# EAGLE design fhd-gs (EAGLE 9.6.2)
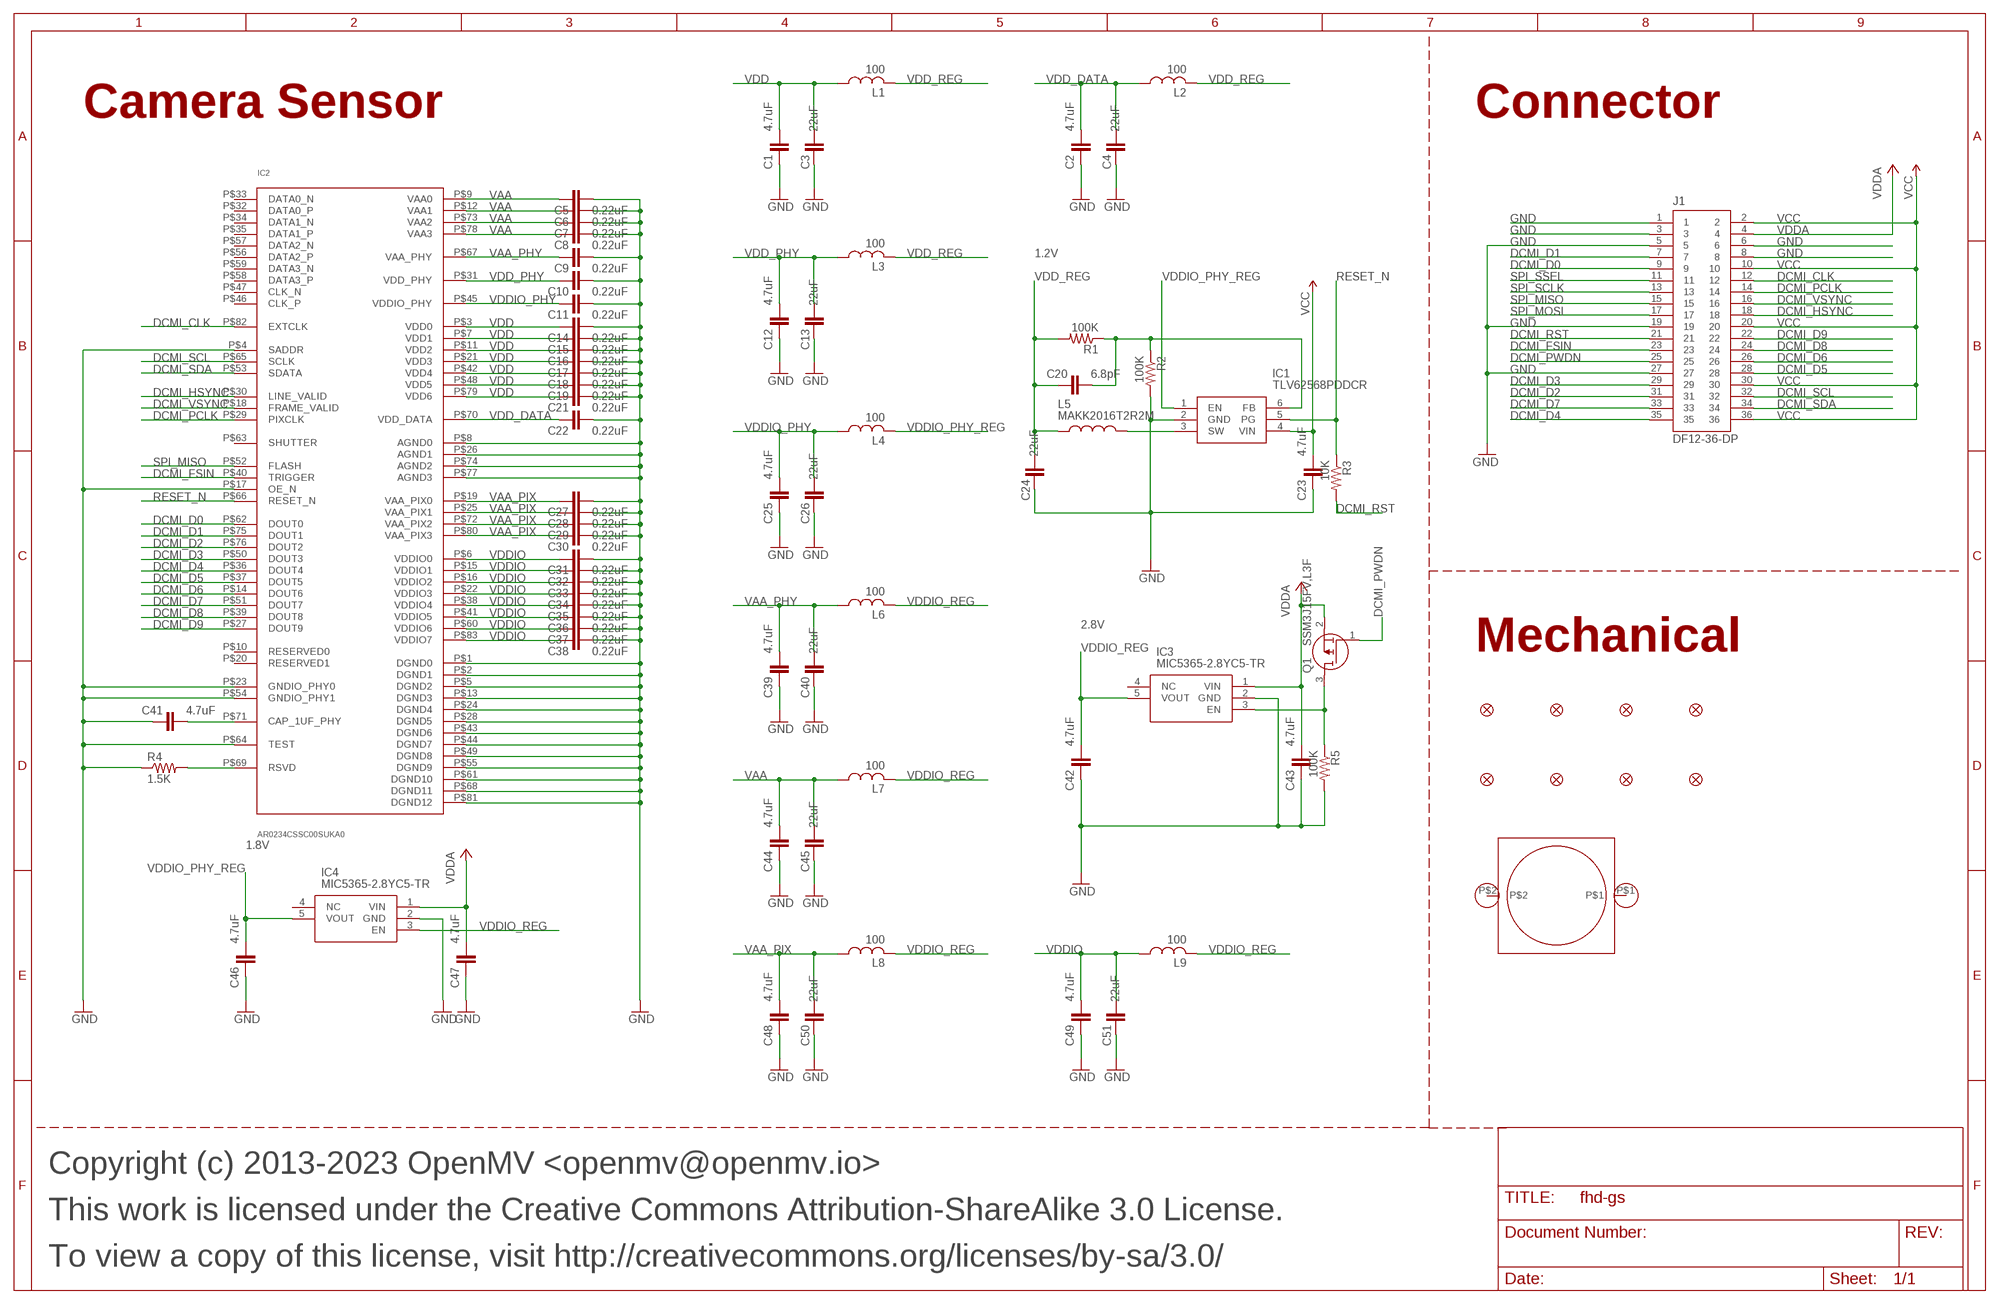
[diagram p0: schematic, sheet 1]

## Parts
C1  4.7uF  CAP_0402  [0402]
C2  4.7uF  CAP_0402  [0402]
C3  22uF  22UF-0805-6.3V-20%  [0805]
C4  22uF  22UF-0805-6.3V-20%  [0805]
C5  0.22uF  C-EUC0201  [C0201]
C6  0.22uF  C-EUC0201  [C0201]
C7  0.22uF  C-EUC0201  [C0201]
C8  0.22uF  C-EUC0201  [C0201]
C9  0.22uF  C-EUC0201  [C0201]
C10  0.22uF  C-EUC0201  [C0201]
C11  0.22uF  C-EUC0201  [C0201]
C12  4.7uF  CAP_0402  [0402]
C13  22uF  22UF-0805-6.3V-20%  [0805]
C14  0.22uF  C-EUC0201  [C0201]
C15  0.22uF  C-EUC0201  [C0201]
C16  0.22uF  C-EUC0201  [C0201]
C17  0.22uF  C-EUC0201  [C0201]
C18  0.22uF  C-EUC0201  [C0201]
C19  0.22uF  C-EUC0201  [C0201]
C20  6.8pF  CAP_0402  [0402]
C21  0.22uF  C-EUC0201  [C0201]
C22  0.22uF  C-EUC0201  [C0201]
C23  4.7uF  CAP_0402  [0402]
C24  22uF  22UF-0805-6.3V-20%  [0805]
C25  4.7uF  CAP_0402  [0402]
C26  22uF  22UF-0805-6.3V-20%  [0805]
C27  0.22uF  C-EUC0201  [C0201]
C28  0.22uF  C-EUC0201  [C0201]
C29  0.22uF  C-EUC0201  [C0201]
C30  0.22uF  C-EUC0201  [C0201]
C31  0.22uF  C-EUC0201  [C0201]
C32  0.22uF  C-EUC0201  [C0201]
C33  0.22uF  C-EUC0201  [C0201]
C34  0.22uF  C-EUC0201  [C0201]
C35  0.22uF  C-EUC0201  [C0201]
C36  0.22uF  C-EUC0201  [C0201]
C37  0.22uF  C-EUC0201  [C0201]
C38  0.22uF  C-EUC0201  [C0201]
C39  4.7uF  CAP_0402  [0402]
C40  22uF  22UF-0805-6.3V-20%  [0805]
C41  4.7uF  CAP_0402  [0402]
C42  4.7uF  CAP_0402  [0402]
C43  4.7uF  CAP_0402  [0402]
C44  4.7uF  CAP_0402  [0402]
C45  22uF  22UF-0805-6.3V-20%  [0805]
C46  4.7uF  CAP_0402  [0402]
C47  4.7uF  CAP_0402  [0402]
C48  4.7uF  CAP_0402  [0402]
C49  4.7uF  CAP_0402  [0402]
C50  22uF  22UF-0805-6.3V-20%  [0805]
C51  22uF  22UF-0805-6.3V-20%  [0805]
FD1  FIDUCIAL1X2  [FIDUCIAL-1X2]
FD2  FIDUCIAL1X2  [FIDUCIAL-1X2]
FD3  FIDUCIAL1X2  [FIDUCIAL-1X2]
FD4  FIDUCIAL1X2  [FIDUCIAL-1X2]
FD5  FIDUCIAL1X2  [FIDUCIAL-1X2]
FD6  FIDUCIAL1X2  [FIDUCIAL-1X2]
FD7  FIDUCIAL1X2  [FIDUCIAL-1X2]
FD8  FIDUCIAL1X2  [FIDUCIAL-1X2]
H1  LENSMOUNT20MM  [LENSMOUNT-20MM]
IC1  TLV62568PDDCR  [SOT95P280X110-6N]
IC2  AR0234CSSC00SUKA0  [AR0234CSSC00SUKA0]
IC3  MIC5365-2.8YC5-TR  [SOT65P210X110-5N]
IC4  MIC5365-2.8YC5-TR  [SOT65P210X110-5N]
J1  DF12-36-DP  [DF12-36-DP]
L1  100  INDUCTOR_0402  [0402]
L2  100  INDUCTOR_0402  [0402]
L3  100  INDUCTOR_0402  [0402]
L4  100  INDUCTOR_0402  [0402]
L5  MAKK2016T2R2M  [INDC2016X100N]
L6  100  INDUCTOR_0402  [0402]
L7  100  INDUCTOR_0402  [0402]
L8  100  INDUCTOR_0402  [0402]
L9  100  INDUCTOR_0402  [0402]
Q1  SSM3J15FV,L3F  [SSM3J15FVL3F]
R1  100K  R-US_R0402  [R0402]
R2  100K  R-US_R0402  [R0402]
R3  10K  R-US_R0402  [R0402]
R4  1.5K  R-US_R0402  [R0402]
R5  100K  R-US_R0402  [R0402]

## Nets
CAP [pwr]: C41.2 IC2.P$71(CAP_1UF_PHY)
DCMI_CLK [signal]: IC2.P$82(EXTCLK) J1.12
DCMI_D0 [signal]: IC2.P$62(DOUT0) J1.9
DCMI_D1 [signal]: IC2.P$75(DOUT1) J1.7
DCMI_D2 [signal]: IC2.P$76(DOUT2) J1.31
DCMI_D3 [signal]: IC2.P$50(DOUT3) J1.29
DCMI_D4 [signal]: IC2.P$36(DOUT4) J1.35
DCMI_D5 [signal]: IC2.P$37(DOUT5) J1.28
DCMI_D6 [signal]: IC2.P$14(DOUT6) J1.26
DCMI_D7 [signal]: IC2.P$51(DOUT7) J1.33
DCMI_D8 [signal]: IC2.P$39(DOUT8) J1.24
DCMI_D9 [signal]: IC2.P$27(DOUT9) J1.22
DCMI_FSIN [signal]: IC2.P$40(TRIGGER) J1.23
DCMI_HSYNC [signal]: IC2.P$30(LINE_VALID) J1.18
DCMI_PCLK [signal]: IC2.P$29(PIXCLK) J1.14
DCMI_PWDN [signal]: J1.25 Q1.1(G)
DCMI_PWDN_INT [signal]: IC3.3(EN) Q1.3(D) R5.1
DCMI_RST [signal]: J1.21 R3.2
DCMI_SCL [signal]: IC2.P$65(SCLK) J1.32
DCMI_SDA [signal]: IC2.P$53(SDATA) J1.34
DCMI_VSYNC [signal]: IC2.P$18(FRAME_VALID) J1.16
FB [pwr]: C20.2 IC1.6(FB) R1.1 R2.1
GND [gnd]: C1.1 C2.1 C3.1 C4.1 C5.2 C6.2 C7.2 C8.2 C9.2 C10.2 C11.2 C12.1 C13.1 C14.2 C15.2 C16.2 C17.2 C18.2 C19.2 C21.2 C22.2 C23.1 C24.1 C25.1 C26.1 C27.2 C28.2 C29.2 C30.2 C31.2 C32.2 C33.2 C34.2 C35.2 C36.2 C37.2 C38.2 C39.1 C40.1 C41.1 C42.1 C43.1 C44.1 C45.1 C46.1 C47.1 C48.1 C49.1 C50.1 C51.1 IC1.2(GND) IC2.P$1(DGND0) IC2.P$2(DGND1) IC2.P$4(SADDR) IC2.P$5(DGND2) IC2.P$8(AGND0) IC2.P$13(DGND3) IC2.P$17(OE_N) IC2.P$23(GNDIO_PHY0) IC2.P$24(DGND4) IC2.P$26(AGND1) IC2.P$28(DGND5) IC2.P$43(DGND6) IC2.P$44(DGND7) IC2.P$49(DGND8) IC2.P$54(GNDIO_PHY1) IC2.P$55(DGND9) IC2.P$61(DGND10) IC2.P$64(TEST) IC2.P$68(DGND11) IC2.P$74(AGND2) IC2.P$77(AGND3) IC2.P$81(DGND12) IC3.2(GND) IC4.2(GND) J1.1 J1.3 J1.5 J1.6 J1.8 J1.19 J1.27 R2.2 R4.1 R5.2
RESET_N [signal]: IC1.5(PG) IC2.P$66(RESET_N) R3.1
RSVD [pwr]: IC2.P$69(RSVD) R4.2
SPI_MISO [signal]: IC2.P$52(FLASH) J1.15
SPI_MOSI [signal]: J1.17
SPI_SCLK [signal]: J1.13
SPI_SSEL [signal]: J1.11
SW [pwr]: IC1.3(SW) L5.2
VAA [pwr]: C5.1 C6.1 C7.1 C8.1 C44.2 C45.2 IC2.P$9(VAA0) IC2.P$12(VAA1) IC2.P$73(VAA2) IC2.P$78(VAA3) L7.1
VAA_PHY [pwr]: C9.1 C39.2 C40.2 IC2.P$67(VAA_PHY) L6.1
VAA_PIX [pwr]: C27.1 C28.1 C29.1 C30.1 C48.2 C50.2 IC2.P$19(VAA_PIX0) IC2.P$25(VAA_PIX1) IC2.P$72(VAA_PIX2) IC2.P$80(VAA_PIX3) L8.1
VCC [pwr]: C23.2 IC1.4(VIN) J1.2 J1.10 J1.20 J1.30 J1.36
VDD [pwr]: C1.2 C3.2 C14.1 C15.1 C16.1 C17.1 C18.1 C19.1 C21.1 IC2.P$3(VDD0) IC2.P$7(VDD1) IC2.P$11(VDD2) IC2.P$21(VDD3) IC2.P$42(VDD4) IC2.P$48(VDD5) IC2.P$79(VDD6) L1.1
VDD_DATA [pwr]: C2.2 C4.2 C22.1 IC2.P$70(VDD_DATA) L2.1
VDD_PHY [pwr]: C10.1 C12.2 C13.2 IC2.P$31(VDD_PHY) L3.1
VDD_REG [pwr]: C20.1 C24.2 L1.2 L2.2 L3.2 L5.1 R1.2
VDDA [pwr]: C43.2 C47.2 IC3.1(VIN) IC4.1(VIN) J1.4 Q1.2(S)
VDDIO [pwr]: C31.1 C32.1 C33.1 C34.1 C35.1 C36.1 C37.1 C38.1 C49.2 C51.2 IC2.P$6(VDDIO0) IC2.P$15(VDDIO1) IC2.P$16(VDDIO2) IC2.P$22(VDDIO3) IC2.P$38(VDDIO4) IC2.P$41(VDDIO5) IC2.P$60(VDDIO6) IC2.P$83(VDDIO7) L9.1
VDDIO_PHY [pwr]: C11.1 C25.2 C26.2 IC2.P$45(VDDIO_PHY) L4.1
VDDIO_PHY_REG [pwr]: C46.2 IC1.1(EN) IC4.5(VOUT) L4.2
VDDIO_REG [pwr]: C42.2 IC3.5(VOUT) IC4.3(EN) L6.2 L7.2 L8.2 L9.2
Unconnected: H1.P$1 H1.P$2 IC2.P$10(RESERVED0) IC2.P$20(RESERVED1) IC2.P$32(DATA0_P) IC2.P$33(DATA0_N) IC2.P$34(DATA1_N) IC2.P$35(DATA1_P) IC2.P$46(CLK_P) IC2.P$47(CLK_N) IC2.P$56(DATA2_P) IC2.P$57(DATA2_N) IC2.P$58(DATA3_P) IC2.P$59(DATA3_N) IC2.P$63(SHUTTER) IC3.4(NC) IC4.4(NC)

## Notes on the sheet
- Camera Sensor | Connector
- 1.2V
- 2.8V
- Mechanical
- 1.8V
- Copyright (c) 2013-2023 OpenMV <openmv@openmv.io>
- This work is licensed under the Creative Commons Attribution-ShareAlike 3.0 License.
- To view a copy of this license, visit http://creativecommons.org/licenses/by-sa/3.0/

## Library data of the parts
C1 C2 C12 C23 C25 C39 C41-C44 C46-C49 = 0402:CAP_0402: 0402 (1005 Metric) Nick Garner - TeleSense; MPN: JMK105BBJ475MV-F
C3 C4 C13 C24 C26 C40 C45 C50 C51 = SparkFun-Capacitors:22UF: 22µF ceramic capacitors A capacitor is a passive two-terminal electrical component used to store electrical energy temporarily in an electric field.; MPN: CL21A226MQQNNNE; PROD_ID: CAP-08402
C5-C11 C14-C19 C21 C22 C27-C38 = rcl:C-EU: CAPACITOR, European symbol; MPN: GRM033R60J224ME15D; SPICEPREFIX: C
C20 = 0402:CAP_0402: 0402 (1005 Metric) Nick Garner - TeleSense; MPN: GRM1555C1H6R8DA01D
FD1-FD8 = SparkFun-Aesthetics:FIDUCIAL: Fiducial Alignment Points Point-of-reference for pick-and-place machines and other optical instruments.
H1 = lensmount:LENSMOUNT
IC1 = TLV62568PDDCR:TLV62568PDDCR: 2.5V-5.5V input, 1A high efficiency step-down buck converter in SOT23 and SOT563 package Source: Datasheet <http://www.ti.com/lit/gpn/tlv62568>; DESCRIPTION: 2.5V-5.5V input, 1A high efficiency step-down buck converter in SOT23 and SOT563 package; HEIGHT: 1.1mm; MANUFACTURER_NAME: Texas Instruments; MANUFACTURER_PART_NUMBER: TLV62568PDDCR; MOUSER_PART_NUMBER: 595-TLV62568PDDCR; MOUSER_PRICE-STOCK: https://www.mouser.co.uk/ProductDetail/Texas-Instruments/TLV62568PDDCR?qs=1mbolxNpo8f1FPchIXcxyQ%3D%3D; MPN: TLV62568PDDCR
IC2 = AR0234CSSC00SUKA0:AR0234CSSC00SUKA0
IC3 IC4 = MIC5365-2.8YC5-TR:MIC5365-2.8YC5-TR: IC REG LINEAR 2.8V 150MA SC70-5 Source: Datasheet <http://www.microchip.com/mymicrochip/filehandler.aspx?ddocname=en580022>; DESCRIPTION: IC REG LINEAR 2.8V 150MA SC70-5; HEIGHT: 1.1mm; MANUFACTURER_NAME: Microchip; MANUFACTURER_PART_NUMBER: MIC5365-2.8YC5-TR; MOUSER_PART_NUMBER: 998-MIC5365-2.8YC5TR; MOUSER_PRICE-STOCK: https://www.mouser.co.uk/ProductDetail/Microchip-Technology-Atmel/MIC5365-2.8YC5-TR?qs=U6T8BxXiZAX3mJDSWJyjVA%3D%3D; MPN: MIC5365-2.8YC5-TR
J1 = DF12NB(3.0)-36DP-0.5V(51):DF12-36-DP; MPN: DF12NB(3.0)-36DP-0.5V(51)
L1-L4 L6-L9 = 0402:INDUCTOR_0402; MPN: MFBM1V1005-101-R
L5 = MAKK2016T2R2M:MAKK2016T2R2M: INDUCTOR, METAL CORE Check availability <https://pricing.snapeda.com/parts/MAKK2016T2R2M/Taiyo%20Yuden/view-part?ref=eda>; AVAILABILITY: In Stock; DESCRIPTION: 2.2 µH Shielded Drum Core, Wirewound Inductor 1.5 A 160mOhm Max 0806 (2016 Metric); MF: Taiyo Yuden; MP: MAKK2016T2R2M; MPN: MAKK2016T2R2M; PACKAGE: 2016 Taiyo Yuden; PRICE: None; PURCHASE-URL: https://pricing.snapeda.com/search/part/MAKK2016T2R2M/?ref=eda
Q1 = SSM3J15FV_L3F:SSM3J15FV,L3F: MOSFET Small-signal MOSFET High Speed Switching Source: Datasheet <https://toshiba.semicon-storage.com/info/docget.jsp?did=593&prodName=SSM3J15FV>; DESCRIPTION: MOSFET Small-signal MOSFET High Speed Switching; HEIGHT: 0.55mm; MANUFACTURER_NAME: Toshiba; MANUFACTURER_PART_NUMBER: SSM3J15FV,L3F; MOUSER_PART_NUMBER: 757-SSM3J15FVL3F; MOUSER_PRICE-STOCK: https://www.mouser.co.uk/ProductDetail/Toshiba/SSM3J15FVL3F?qs=PDgMCp4xDJb4qTgE7FAUzA%3D%3D; MPN: SSM3J15FV,L3F
R1 R2 R5 = rcl:R-US_: RESISTOR, American symbol; MPN: AC0402FR-07100KL; SPICEPREFIX: R
R3 = rcl:R-US_: RESISTOR, American symbol; MPN: AC0402FR-1310KL; SPICEPREFIX: R
R4 = rcl:R-US_: RESISTOR, American symbol; MPN: RC0402FR-131K5L; SPICEPREFIX: R

## Net classes
0 default: width 0.076 mm, drill 0.102 mm, clearance 0.076 mm
2 gnd: width 0.076 mm, drill 0.102 mm, clearance 0.076 mm to class 0, clearance 0.076 mm to class 1, clearance 0.127 mm
3 pwr: width 0.076 mm, drill 0.102 mm, clearance 0.076 mm to class 0, clearance 0.076 mm to class 1, clearance 0.076 mm to class 2, clearance 0.127 mm
4 signal: width 0.076 mm, drill 0.102 mm, clearance 0.076 mm to class 0, clearance 0.076 mm to class 1, clearance 0.076 mm to class 2, clearance 0.076 mm to class 3, clearance 0.127 mm

## Board
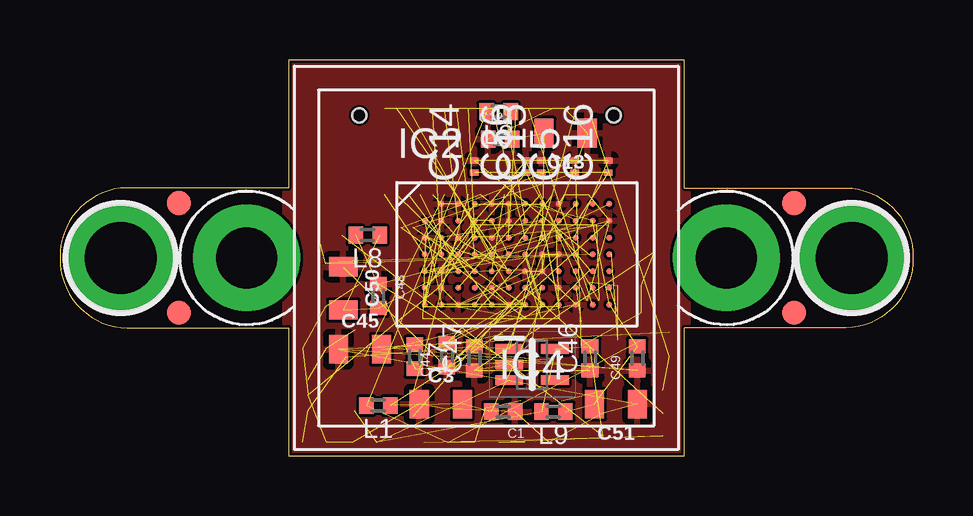
[diagram p1: board, top side]
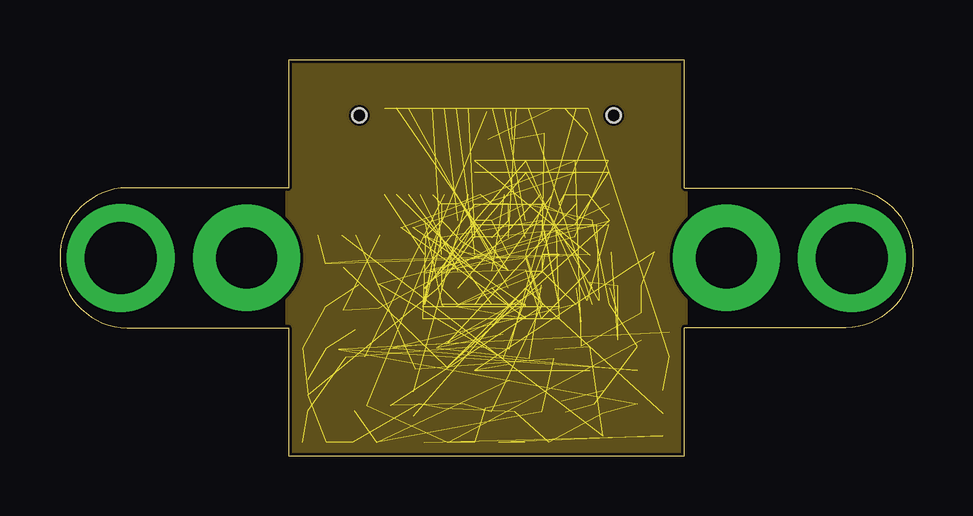
[diagram p2: board, inner layer GND]
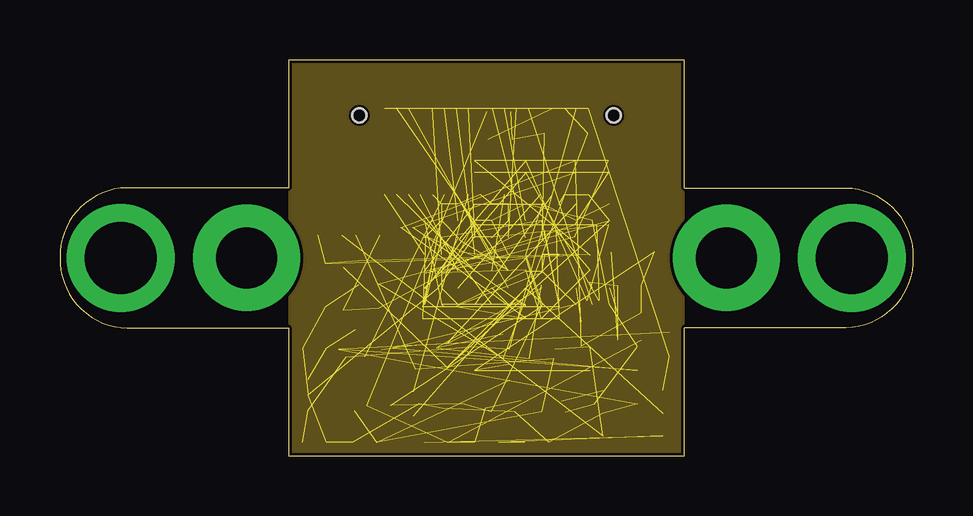
[diagram p3: board, inner layer VCC]
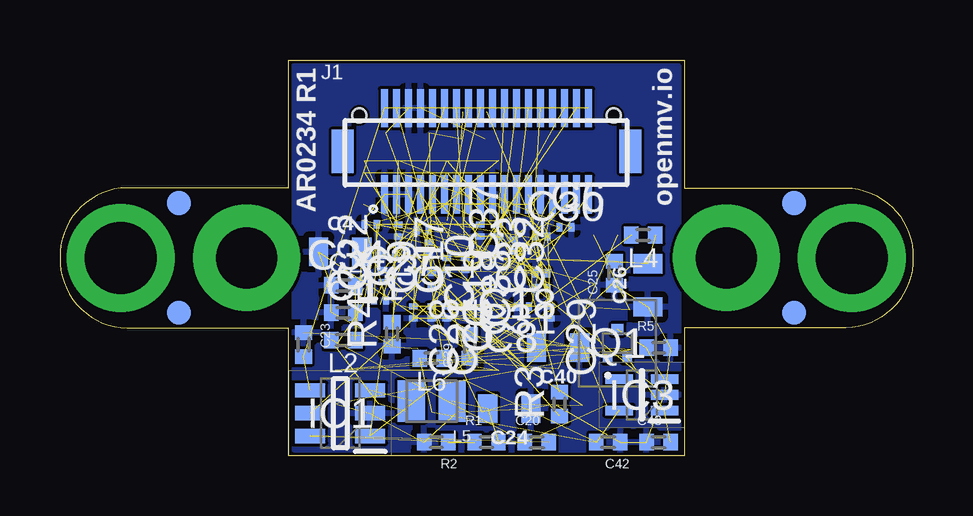
[diagram p4: board, bottom side, seen from below]

Size 35.56 x 16.51 mm. Coordinates in mm from the lower left corner, seen from the top.
Outline: 9.53,16.51 9.53,11.18 2.79,11.18 arc90 0,8.26 arc90 2.79,5.33 9.53,5.33 9.53,0 26.04,0 26.04,5.33 32.77,5.33 arc90 35.56,8.26 arc90 32.77,11.18 26.04,11.18 26.04,16.51 9.53,16.51
Copper layers (1*2*3*14*15*16): Top 0.035mm / dielectric 0.23mm / GND 0.035mm / dielectric 0.38mm / Route3 0.035mm / dielectric 0.15mm / Route14 0.035mm / dielectric 0.38mm / VCC 0.035mm / dielectric 0.23mm / Bottom 0.035mm
Design rules "MF_Ext_4_mil_drill_6_Layer": minimum track width 3mil, minimum drill 4mil, track to track 3mil, track to pad 3mil, pad to pad 3mil, via to via 3mil, smd to smd 0mil, copper to edge 3mil, drill to drill 3mil, minimum pad ring 3mil, minimum via ring 3mil, stop-mask expansion 2mil, vias tented up to drill 25mil, thermal gap 10mil
tKeepout: area 9.5,15.3 to 26,16.5; area 9.5,0 to 10.7,16.5; area 9.5,0 to 26,1.2; area 24.8,0 to 26,16.5

### Footprints (pad centres in the part's own frame; a part is rotated, then mirrored left to right if it is on the bottom)
0402 = smd 0.6 x 0.7: 1 -0.5,0; 2 0.5,0
0805 = smd 0.8 x 1.2: 1 -0.9,0; 2 0.9,0
C0201 = smd 0.25 x 0.35: 1 -0.25,0; 2 0.25,0
FIDUCIAL-1X2 = smd 1 x 1: 1 0,0
LENSMOUNT-20MM = drill 2.54 pad 4.445: P$1 -10,0; P$2 10,0
SOT95P280X110-6N = smd 1.25 x 0.6: 1 -1.25,0.95; 2 -1.25,0; 3 -1.25,-0.95; 4 1.25,-0.95; 5 1.25,0; 6 1.25,0.95
AR0234CSSC00SUKA0 = smd 0.25 x 0.25: P$1 -3.15,2.1; P$2 -2.45,2.1; P$3 -1.75,2.1; P$4 -1.05,2.1; P$5 -0.35,2.1; P$6 0.35,2.1; P$7 1.05,2.1; P$8 1.75,2.1; P$9 2.45,2.1; P$10 3.15,2.1; P$11 3.85,2.1; P$12 -3.85,1.4; P$13 -3.15,1.4; P$14 -2.45,1.4; P$15 -1.75,1.4; P$16 -1.05,1.4; P$17 -0.35,1.4; P$18 0.35,1.4; P$19 1.05,1.4; P$20 1.75,1.4; P$21 2.45,1.4; P$22 3.15,1.4; P$23 3.85,1.4; P$24 -3.85,0.7; P$25 -3.15,0.7; P$26 -2.45,0.7; P$27 -1.75,0.7; P$28 -1.05,0.7; P$29 -0.35,0.7; P$30 0.35,0.7; P$31 1.05,0.7; P$32 1.75,0.7; P$33 2.45,0.7; P$34 3.15,0.7; P$35 3.85,0.7; P$36 -3.85,0; P$37 -3.15,0; P$38 -2.45,0; P$39 -1.75,0; P$40 -1.05,0; P$41 -0.35,0; P$42 0.35,0; P$43 1.05,0; P$44 1.75,0; P$45 2.45,0; P$46 3.15,0; P$47 3.85,0; P$48 -3.85,-0.7; P$49 -3.15,-0.7; P$50 -2.45,-0.7; P$51 -1.75,-0.7; P$52 -1.05,-0.7; P$53 -0.35,-0.7; P$54 0.35,-0.7; P$55 1.05,-0.7; P$56 1.75,-0.7; P$57 2.45,-0.7; P$58 3.15,-0.7; P$59 3.85,-0.7; P$60 -3.85,-1.4; P$61 -3.15,-1.4; P$62 -2.45,-1.4; P$63 -1.75,-1.4; P$64 -1.05,-1.4; P$65 -0.35,-1.4; P$66 0.35,-1.4; P$67 1.05,-1.4; P$68 1.75,-1.4; P$69 2.45,-1.4; P$70 3.15,-1.4; P$71 3.85,-1.4; P$72 -3.85,-2.1; P$73 -3.15,-2.1; P$74 -2.45,-2.1; P$75 -1.75,-2.1; P$76 -1.05,-2.1; P$77 -0.35,-2.1; P$78 0.35,-2.1; P$79 1.05,-2.1; P$80 1.75,-2.1; P$81 2.45,-2.1; P$82 3.15,-2.1; P$83 3.85,-2.1
SOT65P210X110-5N = smd 1.15 x 0.4: 1 -0.95,0.65; 2 -0.95,0; 3 -0.95,-0.65; 4 0.95,-0.65; 5 0.95,0.65
DF12-36-DP = smd 0.3 x 1.6: 1 -4.25,-1.8; 2 -4.25,1.8; 3 -3.75,-1.8; 4 -3.75,1.8; 5 -3.25,-1.8; 6 -3.25,1.8; 7 -2.75,-1.8; 8 -2.75,1.8; 9 -2.25,-1.8; 10 -2.25,1.8; 11 -1.75,-1.8; 12 -1.75,1.8; 13 -1.25,-1.8; 14 -1.25,1.8; 15 -0.75,-1.8; 16 -0.75,1.8; 17 -0.25,-1.8; 18 -0.25,1.8; 19 0.25,-1.8; 20 0.25,1.8; 21 0.75,-1.8; 22 0.75,1.8; 23 1.25,-1.8; 24 1.25,1.8; 25 1.75,-1.8; 26 1.75,1.8; 27 2.25,-1.8; 28 2.25,1.8; 29 2.75,-1.8; 30 2.75,1.8; 31 3.25,-1.8; 32 3.25,1.8; 33 3.75,-1.8; 34 3.75,1.8; 35 4.25,-1.8; 36 4.25,1.8 | smd 0.9 x 1.8: F1 -6,0; F2 6,0 | hole 0.6: -5.3,1.5; 5.3,1.5
INDC2016X100N = smd 1.14 x 1.73: 1 -0.847,0; 2 0.847,0
SSM3J15FVL3F = smd 0.4 x 0.45: 1 -0.4,-0.575; 2 0.4,-0.575 | smd 0.5 x 0.45: 3 0,0.575
R0402 = smd 0.6 x 0.7: 1 -0.5,0; 2 0.5,0

### Placement (x,y rotation side)
C1  18.48,1.84 180 top
C2  23.75,7.11 0 bottom
C3  15.88,2.16 0 top
C4  23.88,8.51 0 bottom
C5  21.46,12.06 90 top
C6  14.48,9.53 0 bottom
C7  19.43,5.97 270 bottom
C8  16.26,6.22 180 bottom
C9  20.07,7.37 90 bottom
C10  20.19,8.64 270 bottom
C11  21.84,8.38 180 bottom
C12  18.35,13.21 0 top
C13  21.08,13.46 180 top
C14  17.27,12.06 90 top
C15  20.07,12.06 90 top
C16  22.86,12.06 90 top
C17  21.46,9.4 270 bottom
C18  15.49,7.62 180 bottom
C19  19.43,8 270 bottom
C20  15.68,0.57 0 bottom
C21  20.07,5.97 270 bottom
C22  22.1,7.49 90 bottom
C23  25.4,4.64 270 bottom
C24  16.83,1.97 180 bottom
C25  12.45,7.62 90 bottom
C26  11.05,7.11 90 bottom
C27  20.45,9.4 180 bottom
C28  20.83,5.97 270 bottom
C29  15.11,5.97 270 bottom
C30  15.49,9.14 0 bottom
C31  15.49,6.99 180 bottom
C32  17.27,9.4 270 bottom
C33  18.03,9.4 270 bottom
C34  22.61,9.65 180 bottom
C35  22.23,6.48 0 bottom
C36  19.43,12.06 90 top
C37  16.64,8.76 90 bottom
C38  18.67,8 270 bottom
C39  18.48,4.57 90 bottom
C40  14.8,4.51 180 bottom
C41  23.75,5.97 0 bottom
C42  12.7,0.57 180 bottom
C43  10.6,0.57 0 bottom
C44  16.13,4.19 90 top
C45  12.51,4.45 0 top
C46  22.1,4.06 90 top
C47  17.27,4.06 90 top
C48  13.27,6.67 270 top
C49  24.07,4.06 90 top
C50  11.81,6.99 270 top
C51  23.18,2.16 180 top
FD1  30.61,5.97 0 top
FD2  30.61,10.54 0 top
FD3  30.61,10.54 0 bottom
FD4  30.61,5.97 0 bottom
FD5  4.95,5.97 0 top
FD6  4.95,10.54 0 top
FD7  4.95,10.54 0 bottom
FD8  4.95,5.97 0 bottom
H1  17.78,8.26 0 top
IC1  23.88,1.78 180 bottom
IC2  19.05,8.4 0 top
IC3  11.3,2.54 180 bottom
IC4  19.68,3.81 0 top
J1  17.78,12.7 0 bottom
L1  13.27,2.1 180 top
L2  23.75,4.83 180 bottom
L3  18.29,14.35 180 top
L4  11.24,9.21 180 bottom
L5  20.07,2.29 180 bottom
L6  20.07,4.06 180 bottom
L7  14.8,4.13 270 top
L8  12.83,9.21 180 top
L9  20.57,1.84 180 top
Q1  12.32,4.7 0 bottom
R1  17.78,0.57 0 bottom
R2  19.88,0.57 180 bottom
R3  14.73,2.16 90 bottom
R4  21.72,5.08 90 bottom
R5  10.6,4.51 0 bottom

### Tracks (layer width: path | path; a pad name or v marks a point on that pad's centre or on a via)
CAP  (1 unrouted)
DCMI_CLK  (1 unrouted)
DCMI_D0  (1 unrouted)
DCMI_D1  (1 unrouted)
  Bottom 0.152: J1.7 20.57,10.86
DCMI_D2  (1 unrouted)
DCMI_D3  (1 unrouted)
DCMI_D4  (1 unrouted)
DCMI_D5  (1 unrouted)
DCMI_D6  (1 unrouted)
DCMI_D7  (1 unrouted)
DCMI_D8  (1 unrouted)
DCMI_D9  (1 unrouted)
DCMI_FSIN  (1 unrouted)
DCMI_HSYNC  (1 unrouted)
DCMI_PCLK  (1 unrouted)
DCMI_PWDN  (1 unrouted)
DCMI_PWDN_INT  (2 unrouted)
DCMI_RST  (1 unrouted)
DCMI_SCL  (1 unrouted)
DCMI_SDA  (1 unrouted)
DCMI_VSYNC  (1 unrouted)
FB  (3 unrouted)
GND  (84 unrouted)
  pour GND (isolate 0.127): 9.53,0 9.53,16.51 26.04,16.51 26.04,0
  pour Top (isolate 0.127): 9.4,-0.13 9.4,16.64 26.16,16.64 26.16,-0.13
  pour Bottom (isolate 0.127): 9.78,0.25 9.78,16.26 25.78,16.26 25.78,0.25
N$3  (via drill 3 pad 4.5)
  other vias: 2.54,8.26
N$4  (via drill 3 pad 4.5)
  other vias: 33.02,8.26
RESET_N  (2 unrouted)
RSVD  (1 unrouted)
SPI_MISO  (1 unrouted)
SW  (1 unrouted)
VAA  (10 unrouted)
VAA_PHY  (4 unrouted)
VAA_PIX  (10 unrouted)
VCC  (6 unrouted)
  Bottom 0.254: J1.20
  pour VCC (isolate 0.127): 9.65,0.13 9.65,16.38 25.91,16.38 25.91,0.13
VDD  (16 unrouted)
VDD_DATA  (4 unrouted)
VDD_PHY  (4 unrouted)
VDD_REG  (6 unrouted)
VDDA  (5 unrouted)
VDDIO  (18 unrouted)
VDDIO_PHY  (4 unrouted)
VDDIO_PHY_REG  (3 unrouted)
VDDIO_REG  (6 unrouted)

### Text on the board
bPlace: openmv.io | AR0234 R1